# Altium schematic sheet Sheet2.SchDoc
size 594 x 420 mm; SheetNumber: 2; SheetTotal: 3
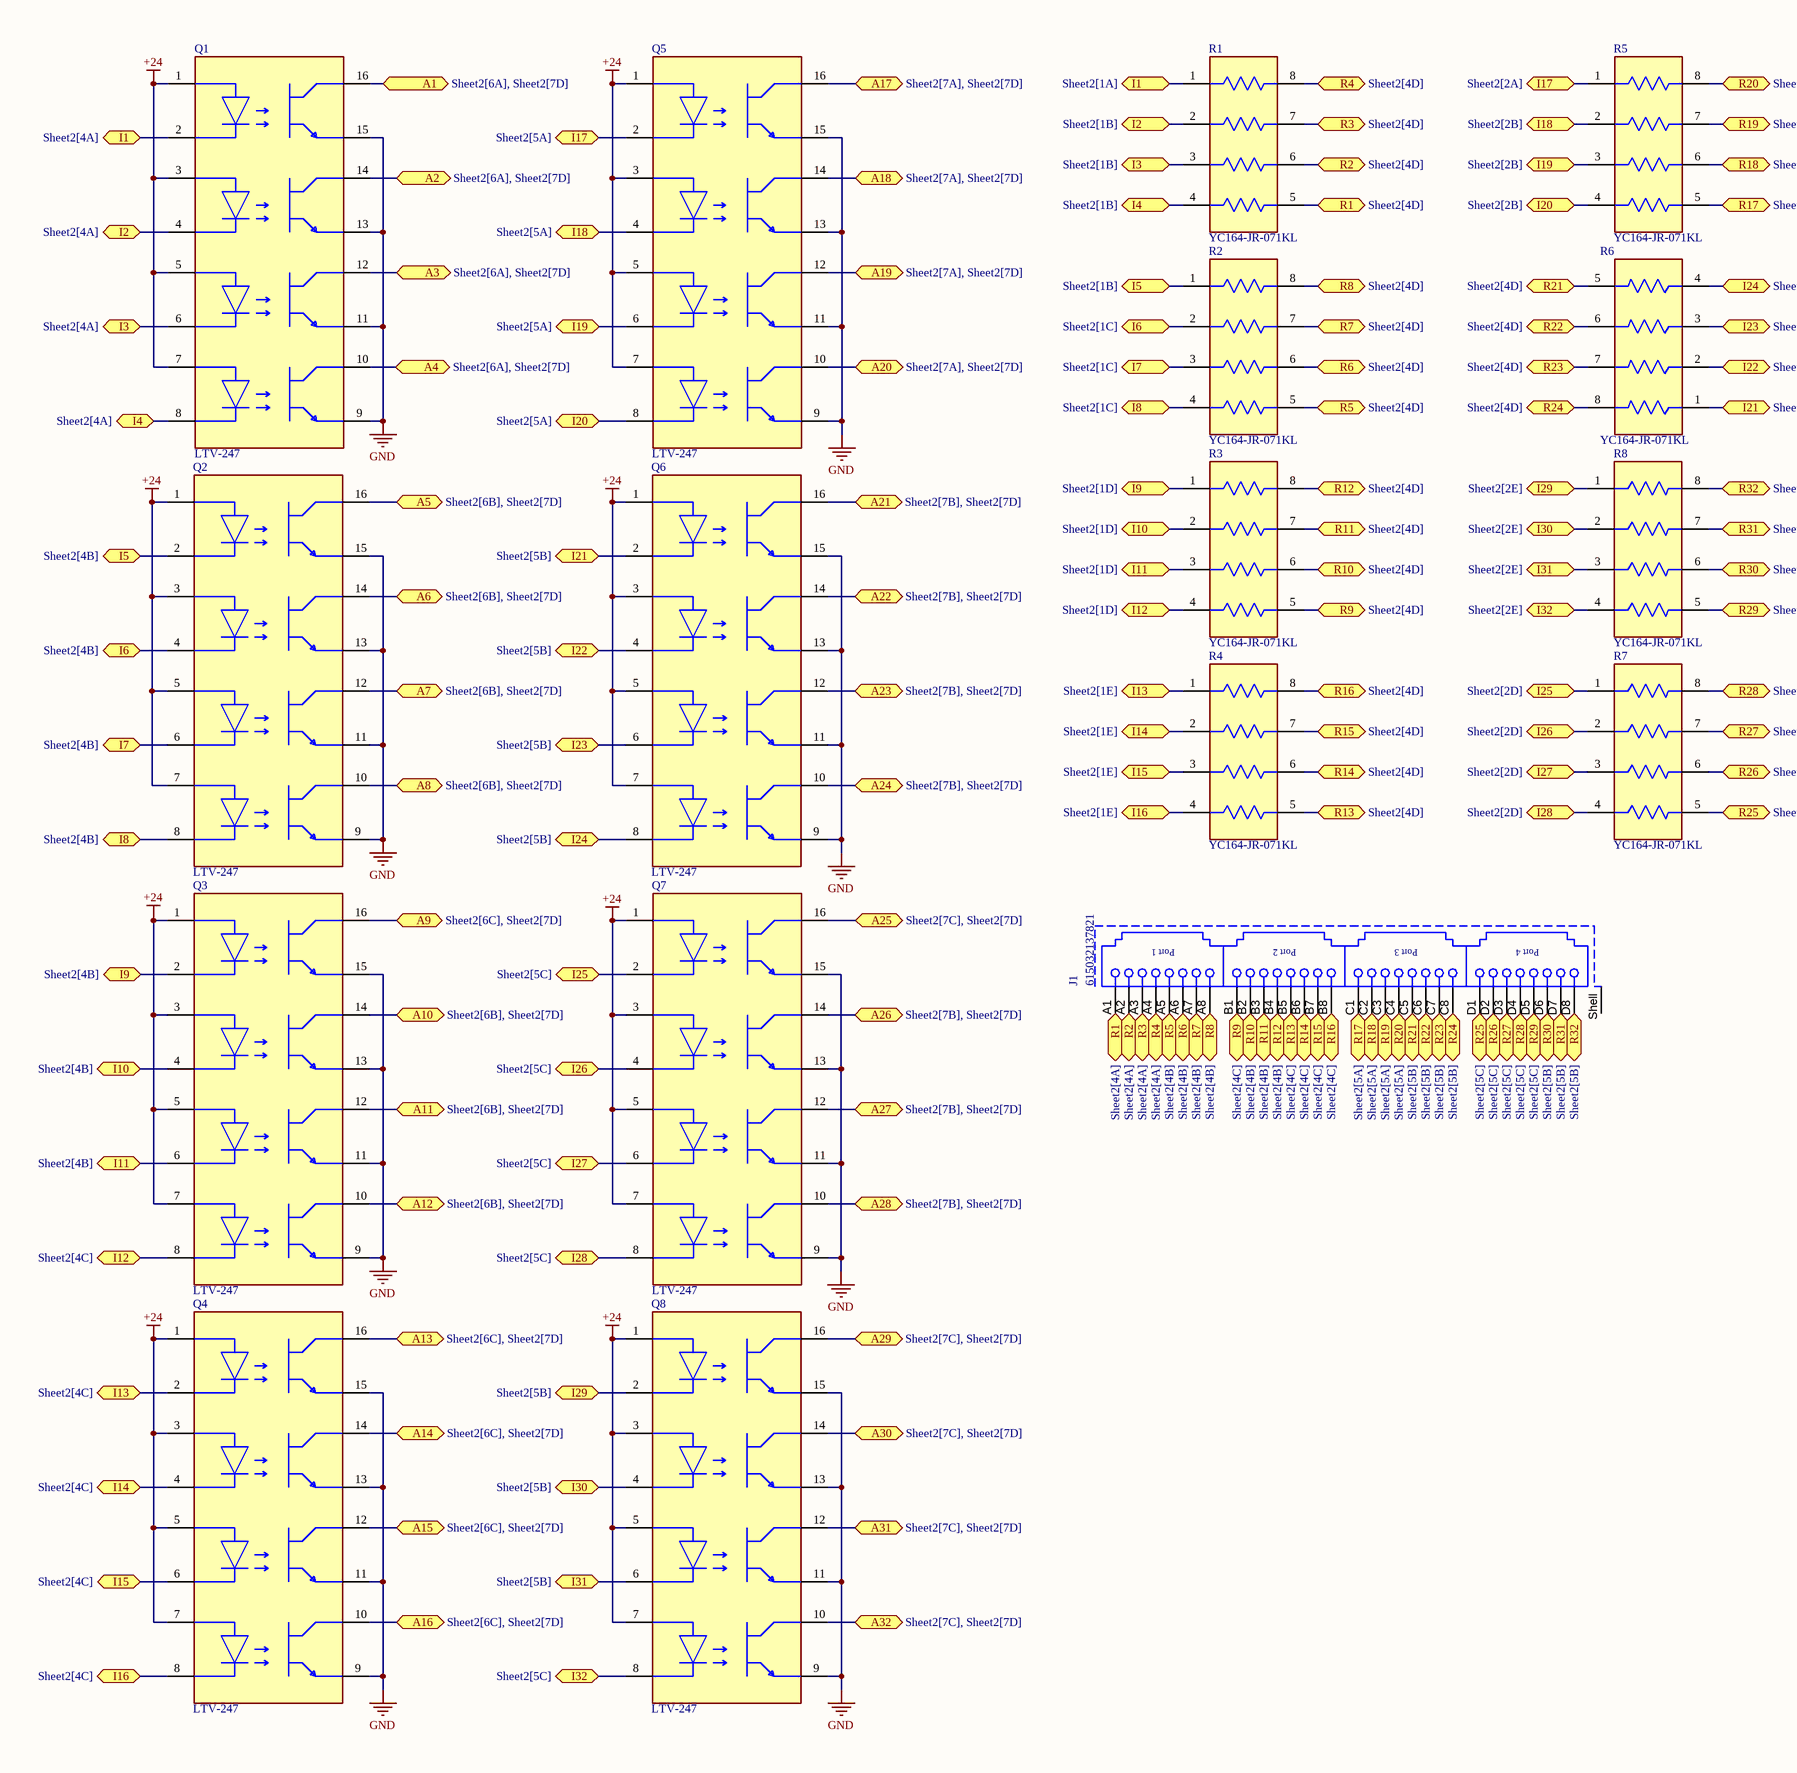
[diagram p0: Sheet2.SchDoc, left]
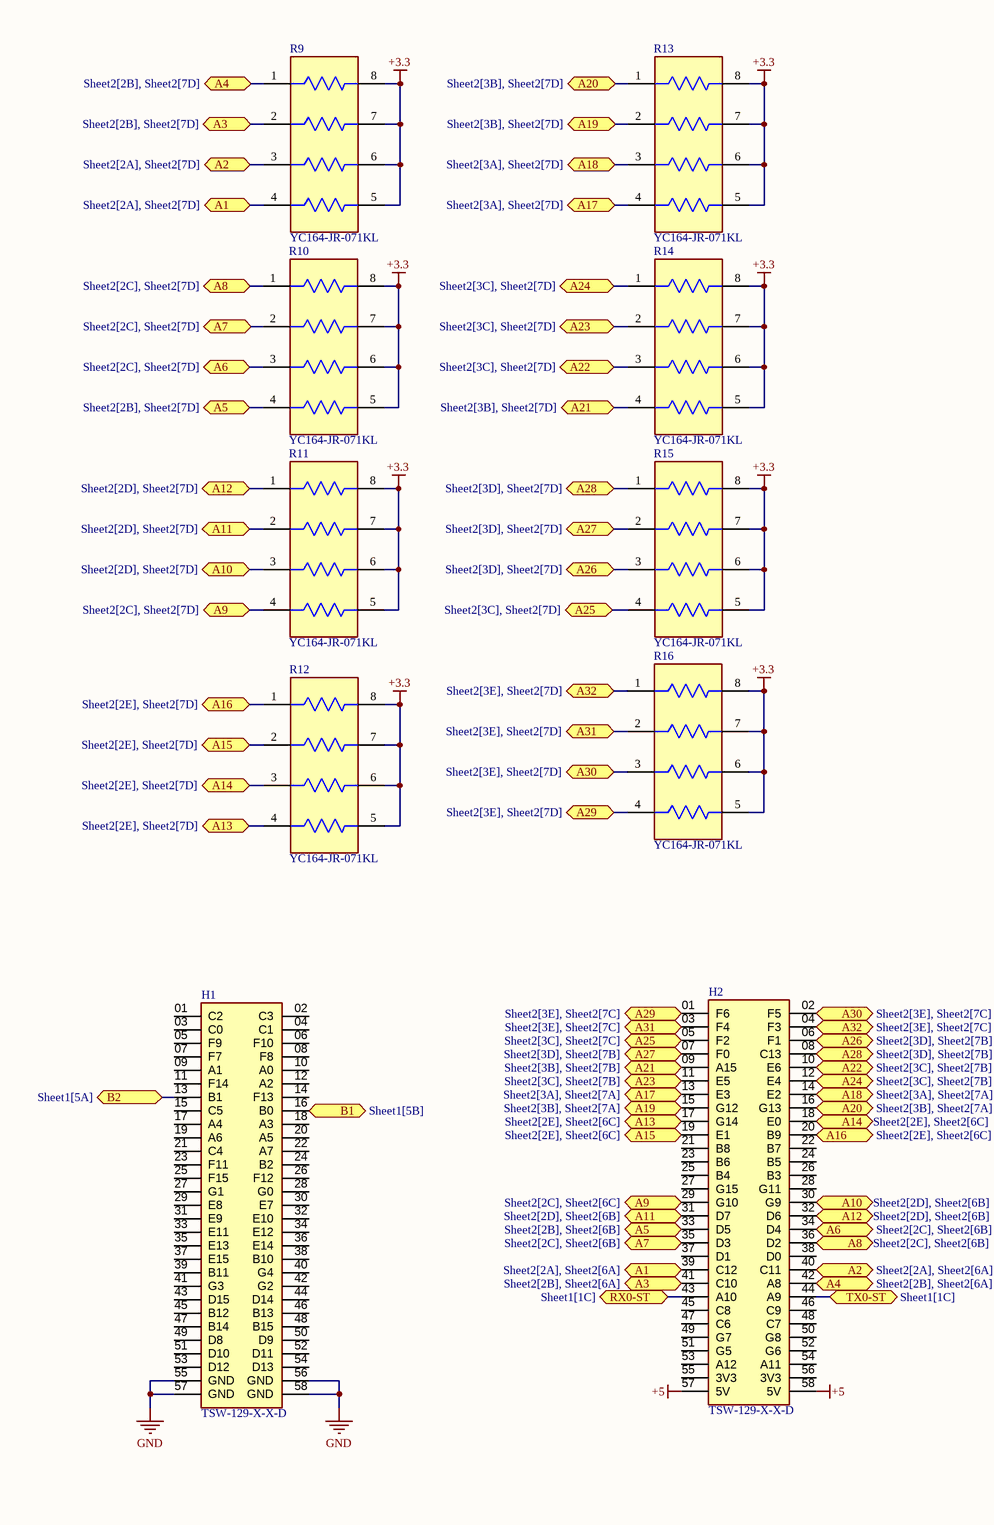
[diagram p1: Sheet2.SchDoc, right]

## Parts
H1  TSW-129-X-X-D  [SAMTEC_TSW-129-X-X-D]
H2  TSW-129-X-X-D  [SAMTEC_TSW-129-X-X-D]
J1  615032137821  [615032137821]
Q1  LTV-247  [FP-LTV-247-MFG]
Q2  LTV-247  [FP-LTV-247-MFG]
Q3  LTV-247  [FP-LTV-247-MFG]
Q4  LTV-247  [FP-LTV-247-MFG]
Q5  LTV-247  [FP-LTV-247-MFG]
Q6  LTV-247  [FP-LTV-247-MFG]
Q7  LTV-247  [FP-LTV-247-MFG]
Q8  LTV-247  [FP-LTV-247-MFG]
R1  YC164-JR-071KL  [FP-YC164-MFG]
R2  YC164-JR-071KL  [FP-YC164-MFG]
R3  YC164-JR-071KL  [FP-YC164-MFG]
R4  YC164-JR-071KL  [FP-YC164-MFG]
R5  YC164-JR-071KL  [FP-YC164-MFG]
R6  YC164-JR-071KL  [FP-YC164-MFG]
R7  YC164-JR-071KL  [FP-YC164-MFG]
R8  YC164-JR-071KL  [FP-YC164-MFG]
R9  YC164-JR-071KL  [FP-YC164-MFG]
R10  YC164-JR-071KL  [FP-YC164-MFG]
R11  YC164-JR-071KL  [FP-YC164-MFG]
R12  YC164-JR-071KL  [FP-YC164-MFG]
R13  YC164-JR-071KL  [FP-YC164-MFG]
R14  YC164-JR-071KL  [FP-YC164-MFG]
R15  YC164-JR-071KL  [FP-YC164-MFG]
R16  YC164-JR-071KL  [FP-YC164-MFG]

## Ports
A1 (bidir, see Sheet2[2A], Sheet2[6A]), A1 (bidir, see Sheet2[2A], Sheet2[7D]), A1 (bidir, see Sheet2[6A], Sheet2[7D]), A2 (bidir, see Sheet2[2A], Sheet2[6A]), A2 (bidir, see Sheet2[2A], Sheet2[7D]), A2 (bidir, see Sheet2[6A], Sheet2[7D]), A3 (bidir, see Sheet2[2B], Sheet2[6A]), A3 (bidir, see Sheet2[2B], Sheet2[7D]), A3 (bidir, see Sheet2[6A], Sheet2[7D]), A4 (bidir, see Sheet2[2B], Sheet2[6A]), A4 (bidir, see Sheet2[2B], Sheet2[7D]), A4 (bidir, see Sheet2[6A], Sheet2[7D]), A5 (bidir, see Sheet2[2B], Sheet2[6B]), A5 (bidir, see Sheet2[2B], Sheet2[7D]), A5 (bidir, see Sheet2[6B], Sheet2[7D]), A6 (bidir, see Sheet2[2C], Sheet2[6B]), A6 (bidir, see Sheet2[2C], Sheet2[7D]), A6 (bidir, see Sheet2[6B], Sheet2[7D]), A7 (bidir, see Sheet2[2C], Sheet2[6B]), A7 (bidir, see Sheet2[2C], Sheet2[7D]), A7 (bidir, see Sheet2[6B], Sheet2[7D]), A8 (bidir, see Sheet2[2C], Sheet2[6B]), A8 (bidir, see Sheet2[2C], Sheet2[7D]), A8 (bidir, see Sheet2[6B], Sheet2[7D]), A9 (bidir, see Sheet2[2C], Sheet2[6C]), A9 (bidir, see Sheet2[2C], Sheet2[7D]), A9 (bidir, see Sheet2[6C], Sheet2[7D]), A10 (bidir, see Sheet2[2D], Sheet2[6B]), A10 (bidir, see Sheet2[2D], Sheet2[7D]), A10 (bidir, see Sheet2[6B], Sheet2[7D]), A11 (bidir, see Sheet2[2D], Sheet2[6B]), A11 (bidir, see Sheet2[2D], Sheet2[7D]), A11 (bidir, see Sheet2[6B], Sheet2[7D]), A12 (bidir, see Sheet2[2D], Sheet2[6B]), A12 (bidir, see Sheet2[2D], Sheet2[7D]), A12 (bidir, see Sheet2[6B], Sheet2[7D]), A13 (bidir, see Sheet2[2E], Sheet2[6C]), A13 (bidir, see Sheet2[2E], Sheet2[7D]), A13 (bidir, see Sheet2[6C], Sheet2[7D]), A14 (bidir, see Sheet2[2E], Sheet2[6C]), A14 (bidir, see Sheet2[2E], Sheet2[7D]), A14 (bidir, see Sheet2[6C], Sheet2[7D]), A15 (bidir, see Sheet2[2E], Sheet2[6C]), A15 (bidir, see Sheet2[2E], Sheet2[7D]), A15 (bidir, see Sheet2[6C], Sheet2[7D]), A16 (bidir, see Sheet2[2E], Sheet2[6C]), A16 (bidir, see Sheet2[2E], Sheet2[7D]), A16 (bidir, see Sheet2[6C], Sheet2[7D]), A17 (bidir, see Sheet2[3A], Sheet2[7A]), A17 (bidir, see Sheet2[3A], Sheet2[7D]), A17 (bidir, see Sheet2[7A], Sheet2[7D]), A18 (bidir, see Sheet2[3A], Sheet2[7A]), A18 (bidir, see Sheet2[3A], Sheet2[7D]), A18 (bidir, see Sheet2[7A], Sheet2[7D]), A19 (bidir, see Sheet2[3B], Sheet2[7A]), A19 (bidir, see Sheet2[3B], Sheet2[7D]), A19 (bidir, see Sheet2[7A], Sheet2[7D]), A20 (bidir, see Sheet2[3B], Sheet2[7A]), A20 (bidir, see Sheet2[3B], Sheet2[7D]), A20 (bidir, see Sheet2[7A], Sheet2[7D]), A21 (bidir, see Sheet2[3B], Sheet2[7B]), A21 (bidir, see Sheet2[3B], Sheet2[7D]), A21 (bidir, see Sheet2[7B], Sheet2[7D]), A22 (bidir, see Sheet2[3C], Sheet2[7B]), A22 (bidir, see Sheet2[3C], Sheet2[7D]), A22 (bidir, see Sheet2[7B], Sheet2[7D]), A23 (bidir, see Sheet2[3C], Sheet2[7B]), A23 (bidir, see Sheet2[3C], Sheet2[7D]), A23 (bidir, see Sheet2[7B], Sheet2[7D]), A24 (bidir, see Sheet2[3C], Sheet2[7B]), A24 (bidir, see Sheet2[3C], Sheet2[7D]), A24 (bidir, see Sheet2[7B], Sheet2[7D]), A25 (bidir, see Sheet2[3C], Sheet2[7C]), A25 (bidir, see Sheet2[3C], Sheet2[7D]), A25 (bidir, see Sheet2[7C], Sheet2[7D]), A26 (bidir, see Sheet2[3D], Sheet2[7B]), A26 (bidir, see Sheet2[3D], Sheet2[7D]), A26 (bidir, see Sheet2[7B], Sheet2[7D]), A27 (bidir, see Sheet2[3D], Sheet2[7B]), A27 (bidir, see Sheet2[3D], Sheet2[7D]), A27 (bidir, see Sheet2[7B], Sheet2[7D]), A28 (bidir, see Sheet2[3D], Sheet2[7B]), A28 (bidir, see Sheet2[3D], Sheet2[7D]), A28 (bidir, see Sheet2[7B], Sheet2[7D]), A29 (bidir, see Sheet2[3E], Sheet2[7C]), A29 (bidir, see Sheet2[3E], Sheet2[7D]), A29 (bidir, see Sheet2[7C], Sheet2[7D]), A30 (bidir, see Sheet2[3E], Sheet2[7C]), A30 (bidir, see Sheet2[3E], Sheet2[7D]), A30 (bidir, see Sheet2[7C], Sheet2[7D]), A31 (bidir, see Sheet2[3E], Sheet2[7C]), A31 (bidir, see Sheet2[3E], Sheet2[7D]), A31 (bidir, see Sheet2[7C], Sheet2[7D]), A32 (bidir, see Sheet2[3E], Sheet2[7C]), A32 (bidir, see Sheet2[3E], Sheet2[7D]), A32 (bidir, see Sheet2[7C], Sheet2[7D]), B1 (bidir, see Sheet1[5B]), B2 (bidir, see Sheet1[5A]), I1 (bidir, see Sheet2[1A]), I1 (bidir, see Sheet2[4A]), I2 (bidir, see Sheet2[1B]), I2 (bidir, see Sheet2[4A]), I3 (bidir, see Sheet2[1B]), I3 (bidir, see Sheet2[4A]), I4 (bidir, see Sheet2[1B]), I4 (bidir, see Sheet2[4A]), I5 (bidir, see Sheet2[1B]), I5 (bidir, see Sheet2[4B]), I6 (bidir, see Sheet2[1C]), I6 (bidir, see Sheet2[4B]), I7 (bidir, see Sheet2[1C]), I7 (bidir, see Sheet2[4B]), I8 (bidir, see Sheet2[1C]), I8 (bidir, see Sheet2[4B]), I9 (bidir, see Sheet2[1D]), I9 (bidir, see Sheet2[4B]), I10 (bidir, see Sheet2[1D]), I10 (bidir, see Sheet2[4B]), I11 (bidir, see Sheet2[1D]), I11 (bidir, see Sheet2[4B]), I12 (bidir, see Sheet2[1D]), I12 (bidir, see Sheet2[4C]), I13 (bidir, see Sheet2[1E]), I13 (bidir, see Sheet2[4C]), I14 (bidir, see Sheet2[1E]), I14 (bidir, see Sheet2[4C]), I15 (bidir, see Sheet2[1E]), I15 (bidir, see Sheet2[4C]), I16 (bidir, see Sheet2[1E]), I16 (bidir, see Sheet2[4C]), I17 (bidir, see Sheet2[2A]), I17 (bidir, see Sheet2[5A]), I18 (bidir, see Sheet2[2B]), I18 (bidir, see Sheet2[5A]), I19 (bidir, see Sheet2[2B]), I19 (bidir, see Sheet2[5A]), I20 (bidir, see Sheet2[2B]), I20 (bidir, see Sheet2[5A]), I21 (bidir, see Sheet2[2B]), I21 (bidir, see Sheet2[5B]), I22 (bidir, see Sheet2[2C]), I22 (bidir, see Sheet2[5B]), I23 (bidir, see Sheet2[2C]), I23 (bidir, see Sheet2[5B]), I24 (bidir, see Sheet2[2C]), I24 (bidir, see Sheet2[5B]), I25 (bidir, see Sheet2[2D]), I25 (bidir, see Sheet2[5C]), I26 (bidir, see Sheet2[2D]), I26 (bidir, see Sheet2[5C]), I27 (bidir, see Sheet2[2D]), I27 (bidir, see Sheet2[5C]), I28 (bidir, see Sheet2[2D]), I28 (bidir, see Sheet2[5C]), I29 (bidir, see Sheet2[2E]), I29 (bidir, see Sheet2[5B]), I30 (bidir, see Sheet2[2E]), I30 (bidir, see Sheet2[5B]), I31 (bidir, see Sheet2[2E]), I31 (bidir, see Sheet2[5B]), I32 (bidir, see Sheet2[2E]), I32 (bidir, see Sheet2[5C]), R1 (bidir, see Sheet2[4A]), R1 (bidir, see Sheet2[4D]), R2 (bidir, see Sheet2[4A]), R2 (bidir, see Sheet2[4D]), R3 (bidir, see Sheet2[4A]), R3 (bidir, see Sheet2[4D]), R4 (bidir, see Sheet2[4A]), R4 (bidir, see Sheet2[4D]), R5 (bidir, see Sheet2[4B]), R5 (bidir, see Sheet2[4D]), R6 (bidir, see Sheet2[4B]), R6 (bidir, see Sheet2[4D]), R7 (bidir, see Sheet2[4B]), R7 (bidir, see Sheet2[4D]), R8 (bidir, see Sheet2[4B]), R8 (bidir, see Sheet2[4D]), R9 (bidir, see Sheet2[4C]), R9 (bidir, see Sheet2[4D]), R10 (bidir, see Sheet2[4B]), R10 (bidir, see Sheet2[4D]), R11 (bidir, see Sheet2[4B]), R11 (bidir, see Sheet2[4D]), R12 (bidir, see Sheet2[4B]), R12 (bidir, see Sheet2[4D]), R13 (bidir, see Sheet2[4C]), R13 (bidir, see Sheet2[4D]), R14 (bidir, see Sheet2[4C]), R14 (bidir, see Sheet2[4D]), R15 (bidir, see Sheet2[4C]), R15 (bidir, see Sheet2[4D]), R16 (bidir, see Sheet2[4C]), R16 (bidir, see Sheet2[4D]), R17 (bidir, see Sheet2[4D]), R17 (bidir, see Sheet2[5A]), R18 (bidir, see Sheet2[4D]), R18 (bidir, see Sheet2[5A]), R19 (bidir, see Sheet2[4D]), R19 (bidir, see Sheet2[5A]), R20 (bidir, see Sheet2[4D]), R20 (bidir, see Sheet2[5A]), R21 (bidir, see Sheet2[4D]), R21 (bidir, see Sheet2[5B]), R22 (bidir, see Sheet2[4D]), R22 (bidir, see Sheet2[5B]), R23 (bidir, see Sheet2[4D]), R23 (bidir, see Sheet2[5B]), R24 (bidir, see Sheet2[4D]), R24 (bidir, see Sheet2[5B]), R25 (bidir, see Sheet2[4D]), R25 (bidir, see Sheet2[5C]), R26 (bidir, see Sheet2[4D]), R26 (bidir, see Sheet2[5C]), R27 (bidir, see Sheet2[5C]), R27 (bidir, see Sheet2[5D]), R28 (bidir, see Sheet2[5C]), R28 (bidir, see Sheet2[5D]), R29 (bidir, see Sheet2[5C]), R29 (bidir, see Sheet2[5D]), R30 (bidir, see Sheet2[5B]), R30 (bidir, see Sheet2[5D]), R31 (bidir, see Sheet2[5B]), R31 (bidir, see Sheet2[5D]), R32 (bidir, see Sheet2[5B]), R32 (bidir, see Sheet2[5D]), RX0-ST (bidir, see Sheet1[1C]), TX0-ST (bidir, see Sheet1[1C])

## Nets
+3.3: R9.5 R9.6 R9.7 R9.8 R10.5 R10.6 R10.7 R10.8 R11.5 R11.6 R11.7 R11.8 R12.5 R12.6 R12.7 R12.8 R13.5 R13.6 R13.7 R13.8 R14.5 R14.6 R14.7 R14.8 R15.5 R15.6 R15.7 R15.8 R16.5 R16.6 R16.7 R16.8
+5: H2.57(5V) H2.58(5V)
+24: Q1.1(1_ANODE) Q1.3(2_ANODE) Q1.5(3_ANODE) Q1.7(4_ANODE) Q2.1(1_ANODE) Q2.3(2_ANODE) Q2.5(3_ANODE) Q2.7(4_ANODE) Q3.1(1_ANODE) Q3.3(2_ANODE) Q3.5(3_ANODE) Q3.7(4_ANODE) Q4.1(1_ANODE) Q4.3(2_ANODE) Q4.5(3_ANODE) Q4.7(4_ANODE) Q5.1(1_ANODE) Q5.3(2_ANODE) Q5.5(3_ANODE) Q5.7(4_ANODE) Q6.1(1_ANODE) Q6.3(2_ANODE) Q6.5(3_ANODE) Q6.7(4_ANODE) Q7.1(1_ANODE) Q7.3(2_ANODE) Q7.5(3_ANODE) Q7.7(4_ANODE) Q8.1(1_ANODE) Q8.3(2_ANODE) Q8.5(3_ANODE) Q8.7(4_ANODE)
GND: H1.55(GND) H1.56(GND) H1.57(GND) H1.58(GND) Q1.9(E) Q1.11(E) Q1.13(E) Q1.15(E) Q2.9(E) Q2.11(E) Q2.13(E) Q2.15(E) Q3.9(E) Q3.11(E) Q3.13(E) Q3.15(E) Q4.9(E) Q4.11(E) Q4.13(E) Q4.15(E) Q5.9(E) Q5.11(E) Q5.13(E) Q5.15(E) Q6.9(E) Q6.11(E) Q6.13(E) Q6.15(E) Q7.9(E) Q7.11(E) Q7.13(E) Q7.15(E) Q8.9(E) Q8.11(E) Q8.13(E) Q8.15(E)
A1: H2.39(C12) Q1.16(C) R9.4 ; port A1
A2: H2.40(C11) Q1.14(C) R9.3 ; port A2
A3: H2.41(C10) Q1.12(C) R9.2 ; port A3
A4: H2.42(A8) Q1.10(C) R9.1 ; port A4
A5: H2.33(D5) Q2.16(C) R10.4 ; port A5
A6: H2.34(D4) Q2.14(C) R10.3 ; port A6
A7: H2.35(D3) Q2.12(C) R10.2 ; port A7
A8: H2.36(D2) Q2.10(C) R10.1 ; port A8
A9: H2.29(G10) Q3.16(C) R11.4 ; port A9
A10: H2.30(G9) Q3.14(C) R11.3 ; port A10
A11: H2.31(D7) Q3.12(C) R11.2 ; port A11
A12: H2.32(D6) Q3.10(C) R11.1 ; port A12
A13: H2.17(G14) Q4.16(C) R12.4 ; port A13
A14: H2.18(E0) Q4.14(C) R12.3 ; port A14
A15: H2.19(E1) Q4.12(C) R12.2 ; port A15
A16: H2.20(B9) Q4.10(C) R12.1 ; port A16
A17: H2.13(E3) Q5.16(C) R13.4 ; port A17
A18: H2.14(E2) Q5.14(C) R13.3 ; port A18
A19: H2.15(G12) Q5.12(C) R13.2 ; port A19
A20: H2.16(G13) Q5.10(C) R13.1 ; port A20
A21: H2.09(A15) Q6.16(C) R14.4 ; port A21
A22: H2.10(E6) Q6.14(C) R14.3 ; port A22
A23: H2.11(E5) Q6.12(C) R14.2 ; port A23
A24: H2.12(E4) Q6.10(C) R14.1 ; port A24
A25: H2.05(F2) Q7.16(C) R15.4 ; port A25
A26: H2.06(F1) Q7.14(C) R15.3 ; port A26
A27: H2.07(F0) Q7.12(C) R15.2 ; port A27
A28: H2.08(C13) Q7.10(C) R15.1 ; port A28
A29: H2.01(F6) Q8.16(C) R16.4 ; port A29
A30: H2.02(F5) Q8.14(C) R16.3 ; port A30
A31: H2.03(F4) Q8.12(C) R16.2 ; port A31
A32: H2.04(F3) Q8.10(C) R16.1 ; port A32
B1: H1.16(B0) ; port B1
B2: H1.13(B1) ; port B2
I1: Q1.2(1_CATHODE) R1.1 ; port I1
I2: Q1.4(2_CATHODE) R1.2 ; port I2
I3: Q1.6(3_CATHODE) R1.3 ; port I3
I4: Q1.8(4_CATHODE) R1.4 ; port I4
I5: Q2.2(1_CATHODE) R2.1 ; port I5
I6: Q2.4(2_CATHODE) R2.2 ; port I6
I7: Q2.6(3_CATHODE) R2.3 ; port I7
I8: Q2.8(4_CATHODE) R2.4 ; port I8
I9: Q3.2(1_CATHODE) R3.1 ; port I9
I10: Q3.4(2_CATHODE) R3.2 ; port I10
I11: Q3.6(3_CATHODE) R3.3 ; port I11
I12: Q3.8(4_CATHODE) R3.4 ; port I12
I13: Q4.2(1_CATHODE) R4.1 ; port I13
I14: Q4.4(2_CATHODE) R4.2 ; port I14
I15: Q4.6(3_CATHODE) R4.3 ; port I15
I16: Q4.8(4_CATHODE) R4.4 ; port I16
I17: Q5.2(1_CATHODE) R5.1 ; port I17
I18: Q5.4(2_CATHODE) R5.2 ; port I18
I19: Q5.6(3_CATHODE) R5.3 ; port I19
I20: Q5.8(4_CATHODE) R5.4 ; port I20
I21: Q6.2(1_CATHODE) R6.1 ; port I21
I22: Q6.4(2_CATHODE) R6.2 ; port I22
I23: Q6.6(3_CATHODE) R6.3 ; port I23
I24: Q6.8(4_CATHODE) R6.4 ; port I24
I25: Q7.2(1_CATHODE) R7.1 ; port I25
I26: Q7.4(2_CATHODE) R7.2 ; port I26
I27: Q7.6(3_CATHODE) R7.3 ; port I27
I28: Q7.8(4_CATHODE) R7.4 ; port I28
I29: Q8.2(1_CATHODE) R8.1 ; port I29
I30: Q8.4(2_CATHODE) R8.2 ; port I30
I31: Q8.6(3_CATHODE) R8.3 ; port I31
I32: Q8.8(4_CATHODE) R8.4 ; port I32
R1: J1.A1 R1.5 ; port R1
R2: J1.A2 R1.6 ; port R2
R3: J1.A3 R1.7 ; port R3
R4: J1.A4 R1.8 ; port R4
R5: J1.A5 R2.5 ; port R5
R6: J1.A6 R2.6 ; port R6
R7: J1.A7 R2.7 ; port R7
R8: J1.A8 R2.8 ; port R8
R9: J1.B1 R3.5 ; port R9
R10: J1.B2 R3.6 ; port R10
R11: J1.B3 R3.7 ; port R11
R12: J1.B4 R3.8 ; port R12
R13: J1.B5 R4.5 ; port R13
R14: J1.B6 R4.6 ; port R14
R15: J1.B7 R4.7 ; port R15
R16: J1.B8 R4.8 ; port R16
R17: J1.C1 R5.5 ; port R17
R18: J1.C2 R5.6 ; port R18
R19: J1.C3 R5.7 ; port R19
R20: J1.C4 R5.8 ; port R20
R21: J1.C5 R6.5 ; port R21
R22: J1.C6 R6.6 ; port R22
R23: J1.C7 R6.7 ; port R23
R24: J1.C8 R6.8 ; port R24
R25: J1.D1 R7.5 ; port R25
R26: J1.D2 R7.6 ; port R26
R27: J1.D3 R7.7 ; port R27
R28: J1.D4 R7.8 ; port R28
R29: J1.D5 R8.5 ; port R29
R30: J1.D6 R8.6 ; port R30
R31: J1.D7 R8.7 ; port R31
R32: J1.D8 R8.8 ; port R32
RX0-ST: H2.43(A10) ; port RX0-ST
TX0-ST: H2.44(A9) ; port TX0-ST

Not connected (* = marked no-connect by the designer): H1 01(C2) 02(C3) 03(C0) 04(C1) 05(F9) 06(F10) 07(F7) 08(F8) 09(A1) 10(A0) 11(F14) 12(A2) 14(F13) 15(C5) 17(A4) 18(A3) 19(A6) 20(A5) 21(C4) 22(A7) 23(F11) 24(B2) 25(F15) 26(F12) 27(G1) 28(G0) 29(E8) 30(E7) 31(E9) 32(E10) 33(E11) 34(E12) 35(E13) 36(E14) 37(E15) 38(B10) 39(B11) 40(G4) 41(G3) 42(G2) 43(D15) 44(D14) 45(B12) 46(B13) 47(B14) 48(B15) 49(D8) 50(D9) 51(D10) 52(D11) 53(D12) 54(D13); H2 21(B8) 22(B7) 23(B6) 24(B5) 25(B4) 26(B3) 27(G15) 28(G11) 37(D1) 38(D0) 45(C8) 46(C9) 47(C6) 48(C7) 49(G7) 50(G8) 51(G5) 52(G6) 53(A12) 54(A11) 55(3V3) 56(3V3); J1 Shell

## Notes on the sheet
- DWG NO:
- REV:
- THIS DOCUMENT AND THE DATA DISCLOSED HEREIN OR
- HEREWITH IS THE PROPERTY OF ALTIUM LIMITED AND MAY
- BE FREELY DISTRIBUTED IN WHOLE. NO RIGHTS ARE
- RESERVED OR EXPRESS OR IMPLIED WARANTEE GIVEN.
- REVISION
- DESCRIPTION
- DATE
- APPROVED
- ENG:
- APPROVALS
- PROJECT
- DSN:
- CHK:
- REFERENCE DOCUMENTS
- PROJECT REVISION:
- TITLE
- DOCUMENT REVISION:
- DESIGN ITEM:
- BOM:
- FAB DWG:
- PCB DWG:
- ASSY DWG:
- SCALE:
- A2
- SIZE
- CAGE CODE
- FILE NAME
- DWG NO.
- SHEET
- OF
- REV
- (in symbol CMP-1502-01711-3) Port 1; Port 2; Port 3; Port 4

## Library data of the parts
H1 H2 = TSW-129-X-X-D: Connector Header Through Hole 58 position 0.100 (2.54mm); MF: Samtec; MP: TSW-129-16-T-D; SnapEDA_Link: https://www.snapeda.com/parts/TSW-129-16-T-D/Samtec/view-part/?ref=snap; Package: None; Value: *; Check_prices: https://www.snapeda.com/parts/TSW-129-16-T-D/Samtec/view-part/?ref=eda
J1 = CMP-1502-01711-3: Modular Jack WR-MJ, Tab Down, Shielded, Ganged 4 Ports, Horizontal Entry, THT, 8P8C; Operating Supply Voltage: 120V; Number of Positions: 8; Insulation Resistance: 500MΩ; Current Rating: 1.5A; Connector Type: RJ45; Contact Resistance: 20mΩ; Gender: Male; Number of Ports: 4; Min Operating Temperature: -40°C; Insulation Material: PBT; Contact Plating: Gold; REACH SVHC: Unknown; RoHS: Compliant; Termination: Through Hole; Max Operating Temperature: 85°C; Number of Contacts: 8; Mount: Through Hole
Q1-Q8 = CMP-22018-000010-1: OPTOISO 3.75KV 4CH TRANS 16SO; Forward Voltage: 1.2V; Collector Emitter Voltage (VCEO): 80V; Forward Current: 20mA; Output Current per Channel: 50mA; Power Dissipation: 170mW; Reverse Breakdown Voltage: 6V; Max Power Dissipation: 200mW; Current Transfer Ratio: 600%; Number of Elements: 4; Collector Emitter Saturation Voltage: 400mV; Package Quantity: 2000; Mount: Surface Mount; Max Operating Temperature: 110°C; Packaging: Tape and Reel; RoHS Compliant: Yes; Case/Package: SMD/SMT; Number of Pins: 16; Min Operating Temperature: -55°C; Max Output Voltage: 80V; Number of Channels: 4; Radiation Hardening: No; Max Input Current: 50mA; Max Collector Current: 50mA
R1-R16 = CMP-03411-000004-1: RES ARRAY 4 RES 1K OHM 1206; Number of Terminals/Pins: 8; Resistance Tolerance: 5%; Temperature Coefficient: 200ppm/°C; Number of Circuits: 4; Resistance: 1kR; Power Per Element: 62.5mW; Voltage Rating: 50V; Circuit Type: Isolated; Case/Package: 0603; RoHS Compliant: Yes; Size Code: 0603; Tolerance: 5%; Min Operating Temperature: -55°C; Height: 0.028inch; Series: YC164; Number of Elements: 4; Length: 0.126inch; Number of Pins: 8; Number of Resistors: 4; Lead Free: Lead Free; Radiation Hardening: No; Max Operating Temperature: 155°C; Case Code (Metric): 3216; Working Voltage: 50V; Case Code (Imperial): 1206; Packaging: Cut Tape; Technology: THICK FILM; Number of Contacts: 8; Width: 0.063inch; Depth: 1.6mm; Terminal Pitch: 0.8mm; Power Dissipation: 62.5mW; Package Quantity: 1; Termination: Convex; Mount: Surface Mount; Military Standard: Not